# Altium schematic sheet connectors.SchDoc: Connection to external devices
size A4; DrawnBy: Juan I Carrano; DocumentNumber: 6; SheetNumber: 6; SheetTotal: 7
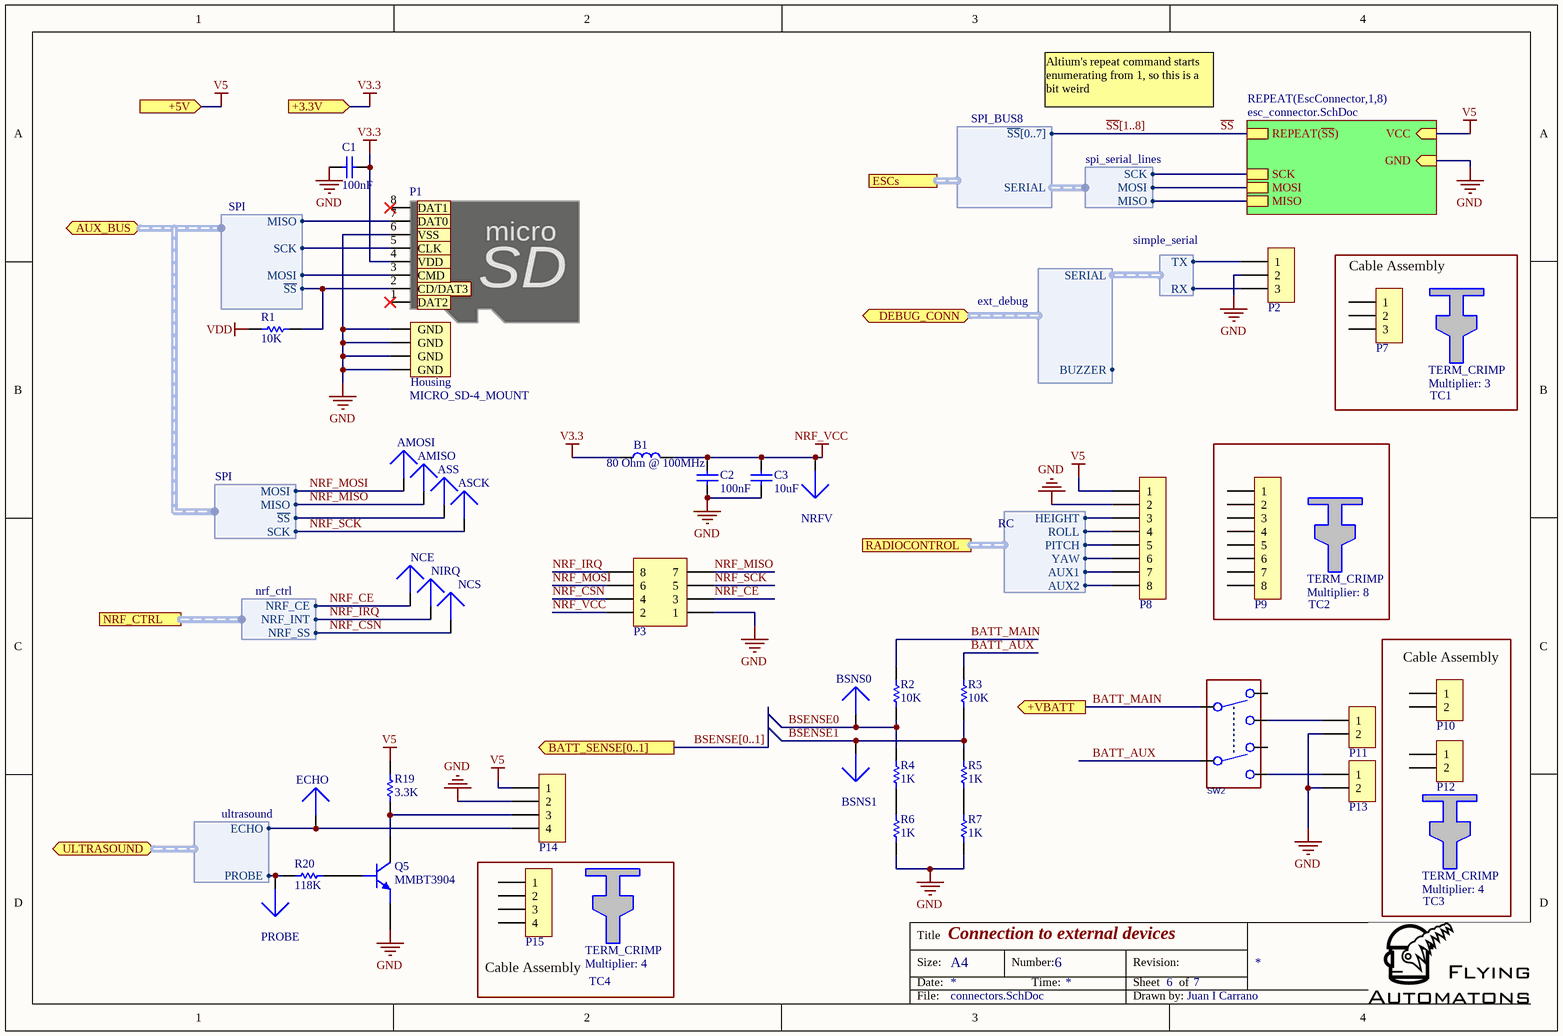
[diagram p0: connectors.SchDoc]

## Parts
AMISO  TESTPOINT-ARROW-BLUE  [G-PIN_1mm-CIRCLE]  (value not drawn)
AMOSI  TESTPOINT-ARROW-BLUE  [G-PIN_1mm-CIRCLE]  (value not drawn)
ASCK  TESTPOINT-ARROW-BLUE  [G-PIN_1mm-CIRCLE]  (value not drawn)
ASS  TESTPOINT-ARROW-BLUE  [G-PIN_1mm-CIRCLE]  (value not drawn)
B1  80 Ohm @ 100MHz  [INDC1608L]
BSNS0  TESTPOINT-ARROW-BLUE  [G-PIN_1mm-CIRCLE]  (value not drawn)
BSNS1  TESTPOINT-ARROW-BLUE  [G-PIN_1mm-CIRCLE]  (value not drawn)
C1  100nF  [CAPC1608L]
C2  100nF  [CAPC1608L]
C3  10uF  [CAPC3216L]
ECHO  TESTPOINT-ARROW-BLUE  [G-PIN_1mm-CIRCLE]  (value not drawn)
NCE  TESTPOINT-ARROW-BLUE  [G-PIN_1mm-CIRCLE]  (value not drawn)
NCS  TESTPOINT-ARROW-BLUE  [G-PIN_1mm-CIRCLE]  (value not drawn)
NIRQ  TESTPOINT-ARROW-BLUE  [G-PIN_1mm-CIRCLE]  (value not drawn)
NRFV  TESTPOINT-ARROW-BLUE  [G-PIN_1mm-CIRCLE]  (value not drawn)
P1  MICRO_SD-4_MOUNT  [X-MOLX_472192001]
P2  HEADER-3x1  [X-JST-S3B-ZR]  (value not drawn)
P3  HEADER-4x2S  [G-HEADER_4x2I.1P_TH]  (value not drawn)
P7  HEADER-3x1_Mech  (value not drawn)  (mechanical)
P8  HEADER-8x1  [X-JST-S8B-ZR]  (value not drawn)
P9  HEADER-8x1_Mech  (value not drawn)  (mechanical)
P10  HEADER-2x1_Mech  (value not drawn)  (mechanical)
P11  HEADER-2x1  [X-JST-S2B-ZR]  (value not drawn)
P12  HEADER-2x1_Mech  (value not drawn)  (mechanical)
P13  HEADER-2x1  [X-JST-S2B-ZR]  (value not drawn)
P14  HEADER-4x1  [X-JST-S4B-ZR]  (value not drawn)
P15  HEADER-4x1_Mech  (value not drawn)  (mechanical)
PROBE  TESTPOINT-ARROW-BLUE  [G-PIN_1mm-CIRCLE]  (value not drawn)
Q5  value MMBT3904  [SOT23-3L]  (hidden comment: BJT-NPN-BEC)
R1  10K  [RESC1608L]
R2  10K  [RESC1608L]
R3  10K  [RESC1608L]
R4  1K  [RESC1608L]
R5  1K  [RESC1608L]
R6  1K  [RESC1608L]
R7  1K  [RESC1608L]
R19  3.3K  [RESC1608L]
R20  118K  [RESC1608L]
SW2  SWITCH-SLIDE-DPDT-LNK  [X-CKC_JS202011AQN]  (value not drawn)
TC1  TERM_CRIMP  Multiplier: 3  (mechanical)
TC2  TERM_CRIMP  Multiplier: 8  (mechanical)
TC3  TERM_CRIMP  Multiplier: 4  (mechanical)
TC4  TERM_CRIMP  Multiplier: 4  (mechanical)

## Blocks framed on the sheet
Cable Assembly: P7 TC1
Cable Assembly: P10 P12 TC3
Cable Assembly: P15 TC4

## Sub-sheets
REPEAT(EscConnector,1,8) = esc_connector.SchDoc: REPEAT(~{SS}), SCK, VCC (in), GND (in), MOSI, MISO

## Ports
+3.3V (in), +5V (in), +VBATT (out), AUX_BUS (harness SPI), BATT_SENSE[0..1] (out), DEBUG_CONN (harness ext_debug), ESCs (harness SPI_BUS8), NRF_CTRL (harness nrf_ctrl), RADIOCONTROL (harness RC), ULTRASOUND (harness ultrasound)

## Harnesses
SPI_BUS8: SERIAL, ~{SS}[0..7]
spi_serial_lines: MISO, MOSI, SCK
ultrasound: PROBE, ECHO
RC: HEIGHT, ROLL, PITCH, YAW, AUX1, AUX2
ext_debug: SERIAL, BUZZER
simple_serial: RX, TX
SPI: SCK, ~{SS}, MISO, MOSI
nrf_ctrl: NRF_INT, NRF_CE, NRF_SS

## Nets
GND: C1.2 C2.2 C3.2 P1.6(VSS) P1.MOUNT1(GND) P1.MOUNT2(GND) P1.MOUNT3(GND) P1.MOUNT4(GND) P2.2 P3.1 P8.2 P11.2 P13.2 P14.2 Q5.2(E) R6.2 R7.2 ; sheet REPEAT(EscConnector,1,8)/GND
NRF_VCC: B1.2 C2.1 C3.1 NRFV.1 P3.2
V3.3: B1.1 C1.1 P1.4(VDD) ; port +3.3V
V5: P8.1 P14.1 R19.1 ; port +5V, sheet REPEAT(EscConnector,1,8)/VCC
VDD: R1.2
BATT_AUX: R3.1 SW2.A2
BATT_MAIN: R2.1 SW2.A1 ; port +VBATT
BSENSE0: BSNS0.1 R2.2 R4.1
BSENSE1: BSNS1.1 R3.2 R5.1
NRF_CE: NCE.1 P3.3 ; port NRF_CTRL.NRF_CE
NRF_CSN: NCS.1 P3.4 ; port NRF_CTRL.NRF_SS
NRF_IRQ: NIRQ.1 P3.8 ; port NRF_CTRL.NRF_INT
NRF_MISO: AMISO.1 P1.7(DAT0) P3.7 ; port AUX_BUS.MISO
NRF_MOSI: AMOSI.1 P1.3(CMD) P3.6 ; port AUX_BUS.MOSI
NRF_SCK: ASCK.1 P1.5(CLK) P3.5 ; port AUX_BUS.SCK
~{SS}: sheet REPEAT(EscConnector,1,8)/REPEAT(~{SS})
NetASS_1: ASS.1 P1.2(CD/DAT3) R1.1 ; port AUX_BUS.~{SS}
NetECHO_1: ECHO.1 P14.4 ; port ULTRASOUND.ECHO
NetP2_1: P2.1 ; harness simple_serial.TX
NetP2_3: P2.3 ; harness simple_serial.RX
NetP8_3: P8.3 ; port RADIOCONTROL.HEIGHT
NetP8_4: P8.4 ; port RADIOCONTROL.ROLL
NetP8_5: P8.5 ; port RADIOCONTROL.PITCH
NetP8_6: P8.6 ; port RADIOCONTROL.YAW
NetP8_7: P8.7 ; port RADIOCONTROL.AUX1
NetP8_8: P8.8 ; port RADIOCONTROL.AUX2
NetP11_1: P11.1 SW2.C1
NetP13_1: P13.1 SW2.C2
NetP14_3: P14.3 Q5.3(C) R19.2
NetPROBE_1: PROBE.1 R20.2 ; port ULTRASOUND.PROBE
NetQ5_1: Q5.1(B) R20.1
NetR4_2: R4.2 R6.1
NetR5_2: R5.2 R7.1
(unnamed): sheet REPEAT(EscConnector,1,8)/SCK, harness spi_serial_lines.SCK
(unnamed): sheet REPEAT(EscConnector,1,8)/MOSI, harness spi_serial_lines.MOSI
(unnamed): sheet REPEAT(EscConnector,1,8)/MISO, harness spi_serial_lines.MISO

Not connected (* = marked no-connect by the designer): P1 1(DAT2)* 8(DAT1)*; P7 1 2 3; P9 1 2 3 4 5 6 7 8; P10 1 2; P12 1 2; P15 1 2 3 4; SW2 B1 B2

## Buses and harness runs
bus BSENSE[0..1] = port BATT_SENSE[0..1]
bus ~{SS}[1..8]

## Notes on the sheet
- Altium's repeat command starts enumerating from 1, so this is a bit weird
- Title
- Size:
- Date:
- A4
- Number:
- Time:
- Revision:
- Sheet
- of
- File:
- Drawn by:
- (in symbol CONN_MICRO_SD-4_MOUNT) micro; SD; Housing

## Library data of the parts
AMISO AMOSI ASCK ASS BSNS0 BSNS1 ECHO NCE NCS NIRQ NRFV PROBE = TESTP_SIG_1mm: Tespoint; Name: TESTP_SIG_1mm
B1 = FERR_80/100M_0603_600m: FERRITE CHIP 80 OHM 600MA 0603; Manufacturer: Samsung Electro-Mechanics America, Inc; Manufacturer Part Number: CIM10U800NC; Name: FERR_80/100M_0603_600m; Value: 80 Ohm @ 100MHz; Supplier 1: Digi-Key; Supplier Part Number 1: 1276-6386-1-ND
C1 C2 = CAP_100n_0603_50V_Y5V: CAP CER 0.1UF 50V Y5V 0603; Manufacturer Part Number: CC0603ZRY5V9BB104; Name: CAP_100n_0603_50V_Y5V; Value: 100nF; Supplier 1: Digi-Key; Supplier Part Number 1: 311-1343-1-ND
C3 = CAP_10u_1206_25V_Y5V: CAP CER 10UF 25V Y5V 1206; Manufacturer Part Number: TMK316F106ZL-T; Name: CAP_10u_1206_25V_Y5V; Value: 10uF; Supplier 1: Digi-Key; Supplier Part Number 1: 587-1353-1-ND
P1 = CONN_MICRO_SD-4_MOUNT: CONN MEMORY CARD R/A 8POS SMD; Manufacturer: Molex; Manufacturer Part Number: 472192001; Name: CONN_MICRO_SD-4_MOUNT; Supplier 1: Digi-Key; Supplier Part Number 1: WM6698CT-ND
P2 = HEADER_3x1_1.5mm_ZH_TH: CONN HEADER ZH SIDE 3POS 1.5MM; Manufacturer: JST Sales America Inc; Manufacturer Part Number: S3B-ZR(LF)(SN); Name: HEADER_3x1_1.5mm_ZH_TH; Supplier 1: Digi-Key; Supplier Part Number 1: 455-1670-ND
P3 = HEADER_4x2_100mil_F: CONN HEADER FMAL 8PS .1" DL GOLD; Name: HEADER_4x2_100mil_F; Supplier 1: SyC; Supplier Part Number 1: PB08D-H
P7 = HOUSING_3x1_1.5mm_ZH: CONN HOUSING ZH 3POS 1.5MM WHT; Manufacturer: JST Sales America Inc; Manufacturer Part Number: ZHR-3; Name: HOUSING_3x1_1.5mm_ZH; Supplier 1: Digi-Key; Supplier Part Number 1: 455-1160-ND
P8 = HEADER_8x1_1.5mm_ZH_TH: CONN HEADER ZH SIDE 8POS 1.5MM; Manufacturer: JST Sales America Inc; Manufacturer Part Number: S8B-ZR(LF)(SN); Name: HEADER_8x1_1.5mm_ZH_TH; Supplier 1: Digi-Key; Supplier Part Number 1: 455-1675-ND
P9 = HOUSING_8x1_1.5mm_ZH: CONN HOUSING ZH 8POS 1.5MM WHT; Manufacturer: JST Sales America Inc; Manufacturer Part Number: ZHR-8; Name: HOUSING_8x1_1.5mm_ZH; Supplier 1: Digi-Key; Supplier Part Number 1: 455-1199-ND
P10 P12 = HOUSING_2x1_1.5mm_ZH: CONN HOUSING ZH 2POS 1.5MM WHT; Manufacturer: JST Sales America Inc; Manufacturer Part Number: ZHR-2; Name: HOUSING_2x1_1.5mm_ZH; Supplier 1: Digi-Key; Supplier Part Number 1: 455-1366-ND
P11 P13 = HEADER_2x1_1.5mm_ZH_TH: CONN HEADER ZH SIDE 2POS 1.5MM; Manufacturer: JST Sales America Inc; Manufacturer Part Number: S2B-ZR(LF)(SN); Name: HEADER_2x1_1.5mm_ZH_TH; Supplier 1: Digi-Key; Supplier Part Number 1: 455-1669-ND
P14 = HEADER_4x1_1.5mm_ZH_TH: CONN HEADER ZH SIDE 4POS 1.5MM; Manufacturer: JST Sales America Inc; Manufacturer Part Number: S4B-ZR(LF)(SN); Name: HEADER_4x1_1.5mm_ZH_TH; Supplier 1: Digi-Key; Supplier Part Number 1: 455-1671-ND
P15 = HOUSING_4x1_1.5mm_ZH: CONN HOUSING ZH 4POS 1.5MM WHT; Manufacturer: JST Sales America Inc; Manufacturer Part Number: ZHR-4; Name: HOUSING_4x1_1.5mm_ZH; Supplier 1: Digi-Key; Supplier Part Number 1: 455-1202-ND
Q5 = MMBT3904: TRANSISTOR NPN 40V 0.2A SOT23; Manufacturer: NXP Semiconductors; Name: MMBT3904; Manufacturer Part Number: MMBT3904; Supplier 1: Digi-Key; Supplier Part Number 1: 568-4510-1-ND
R1-R3 = RES_10K_0603_0W1_1%: RES 10K OHM 1/10W 5% 0603; Manufacturer Part Number: RC1608J103CS; Name: RES_10K_0603_0W1_1%; Value: 10K; Supplier 1: Digi-Key; Supplier Part Number 1: 1276-5086-1-ND
R4-R7 = RES_1K_0603_0W1_1%: RES 1K OHM 1/10W 5% 0603; Manufacturer Part Number: RMCF0603JT1K00; Name: RES_1K_0603_0W1_1%; Value: 1K; Supplier 1: Digi-Key; Supplier Part Number 1: RMCF0603JT1K00CT-ND
R19 = RES_3K3_0603_0W1_1%: RES 3.3K OHM 1/10W 1% 0603 SMD; Manufacturer: Rohm Semiconductor; Manufacturer Part Number: MCR03ERTF3301; Name: RES_3K3_0603_0W1_1%; Value: 3.3K; Supplier 1: Digi-Key; Supplier Part Number 1: RHM3.30KCFCT-ND
R20 = RES_118K_0603_0W1_1%: RES 118K OHM 1/10W 1% 0603; Manufacturer Part Number: RMCF0603FT118K; Name: RES_118K_0603_0W1_1%; Value: 118K; Supplier 1: Digi-Key; Supplier Part Number 1: RMCF0603FT118KCT-ND
SW2 = SW_SLIDE_DPDT_9x3.6mm_S_A2_TH: SW SLIDE DPDT 6VDC 0.3A PCMNT; Manufacturer: C&K Components; Manufacturer Part Number: JS202011AQN; Drawn By: Juan I Carrano; Name: SW_SLIDE_DPDT_9x3.6mm_S_A2_TH; Value: 0.3A; Supplier 1: Digi-Key; Supplier Part Number 1: 401-2000-ND
TC1-TC4 = TCRIMP_ZH_28-32AWG: CONN TERM CRIMP ZH 28-32AWG TIN; Manufacturer: JST Sales America Inc; Manufacturer Part Number: SZH-003T-P0.5; Name: TCRIMP_ZH_28-32AWG; Supplier 1: Digi-Key; Supplier Part Number 1: 455-1281-1-ND